# EAGLE design untitled (EAGLE 9.6.2)
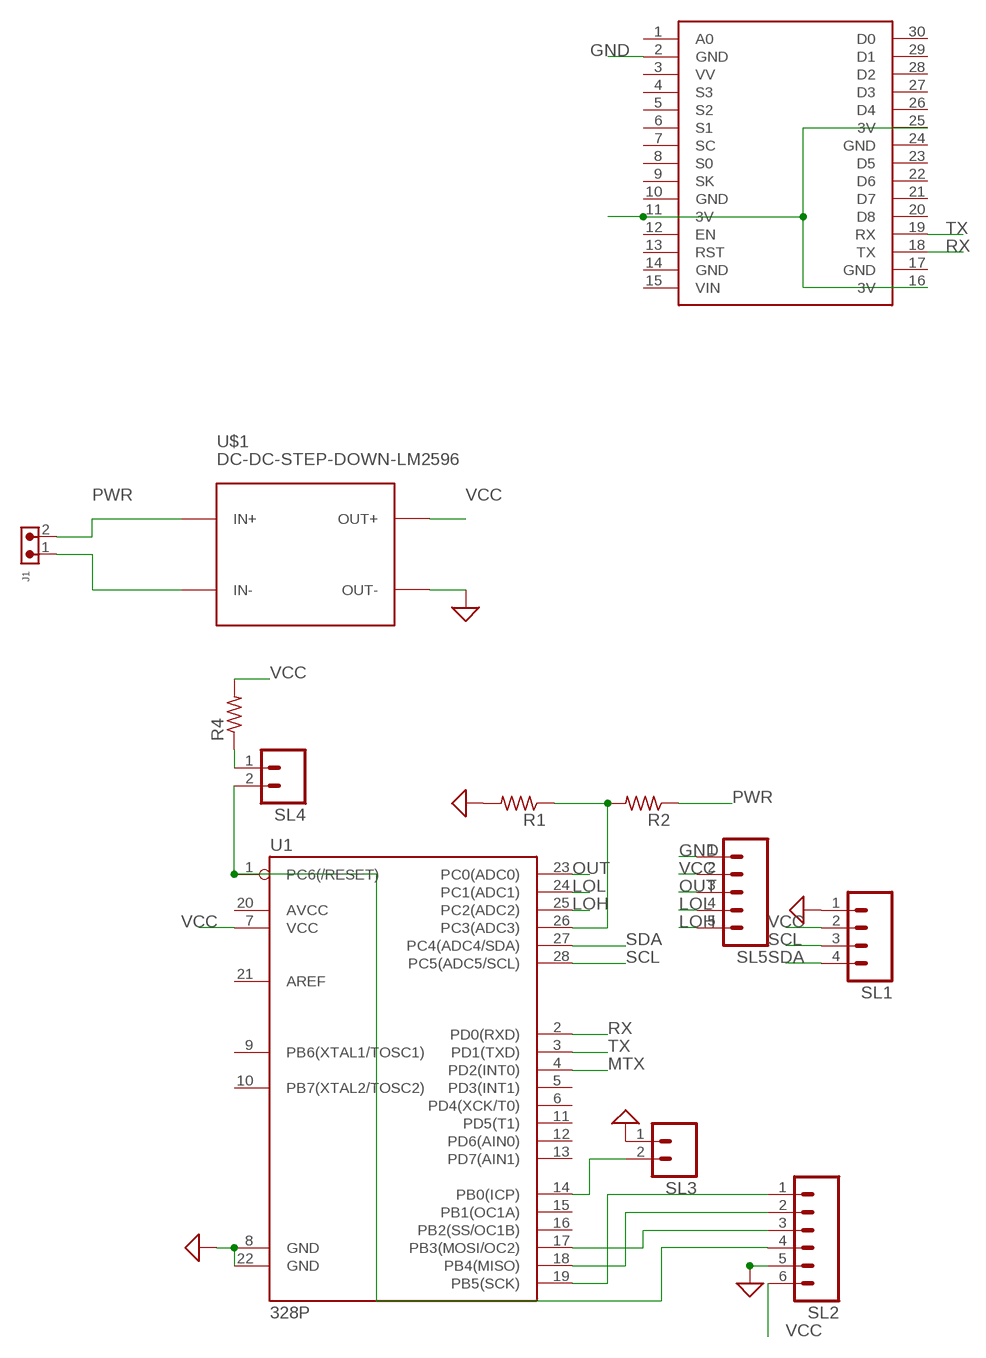
[diagram p0: schematic, sheet 1]

## Parts
J1  691305530002  [691305530002]
R1  R-US_0207/10  [0207/10]
R2  R-US_0207/10  [0207/10]
R4  R-US_0207/10  [0207/10]
SL1  M04  [04P]
SL2  M06  [06P]
SL3  M02  [02P]
SL4  M02  [02P]
SL5  M05  [05P]
U1  328P  ATMEGA328P_PDIP  [DIP28]
U$1  DC-DC-STEP-DOWN-LM2596  [DC-DC-STEP-DOWN-LM2596]
U$3  NODEMCU  [NODEMCU]

## Nets
GND: R1.2 SL1.1 SL2.5 SL3.1 SL5.1 U1.8(GND) U1.22(GND) U$1.OUT- U$3.2(GND) ; supply symbol labelled SUP
LOH: SL5.5 U1.25(PC2(ADC2))
LOL: SL5.4 U1.24(PC1(ADC1))
MTX: U1.4(PD2(INT0))
N$1: R1.1 R2.2 U1.26(PC3(ADC3))
N$2: J1.1 U$1.IN-
N$3: SL3.2 U1.14(PB0(ICP))
N$4: SL2.1 U1.19(PB5(SCK))
N$5: SL2.2 U1.18(PB4(MISO))
N$6: SL2.3 U1.17(PB3(MOSI/OC2))
N$7: SL2.4 SL4.2 U1.1(PC6(/RESET))
N$14: R4.1 SL4.1
OUT: SL5.3 U1.23(PC0(ADC0))
PWR: J1.2 R2.1 U$1.IN+
RX: U1.2(PD0(RXD)) U$3.18(TX)
SCL: SL1.3 U1.28(PC5(ADC5/SCL))
SDA: SL1.4 U1.27(PC4(ADC4/SDA))
TX: U1.3(PD1(TXD)) U$3.19(RX)
VCC: R4.2 SL1.2 SL2.6 SL5.2 U1.7(VCC) U$1.OUT+ U$3.11(3V) U$3.16(3V) U$3.25(3V)
Unconnected: U1.5(PD3(INT1)) U1.6(PD4(XCK/T0)) U1.9(PB6(XTAL1/TOSC1)) U1.10(PB7(XTAL2/TOSC2)) U1.11(PD5(T1)) U1.12(PD6(AIN0)) U1.13(PD7(AIN1)) U1.15(PB1(OC1A)) U1.16(PB2(SS/OC1B)) U1.20(AVCC) U1.21(AREF) U$3.1(A0) U$3.3(VV) U$3.4(S3) U$3.5(S2) U$3.6(S1) U$3.7(SC) U$3.8(S0) U$3.9(SK) U$3.12(EN) U$3.13(RST) U$3.15(VIN) U$3.20(D8) U$3.21(D7) U$3.22(D6) U$3.23(D5) U$3.26(D4) U$3.27(D3) U$3.28(D2) U$3.29(D1) U$3.30(D0)

## Power pins joined to a net without a drawn wire
GND: U$3.10(GND) U$3.14(GND) U$3.17(GND) U$3.24(GND)

## Library data of the parts
J1 = Wurth_Connectors_WR-TBL Pluggable Connector:691305530002: WR-TBL Serie 3055 - 5,08 mm - PCB Header Vertical Entry with Plastic Latches KIND PROPERTIES Pitch 5.08 mm MATERIAL PROPERTIES Insulator Material PA66 Insulator Flammability Rating UL94 V-0 Insulator Color Green Terminal Material Copper Alloy Terminal Plating Tin-plated surface GENERAL INFORMATION Operating Temperature -40 up to +105 °C ELECTRICAL PROPERTIES IR UL 16 A Working Voltage [UL] 300 V (AC) Withstanding Voltage [UL] 2500 V (AC) Contact Resistance [UL] 20 mΩ CERTIFICATION UL Approval E315414 <https://www.we-online.com/catalog/media/o135349v209%20Family_WR-TBL3_6913055300xx.jpg> Details see: https://www.we-online.com/catalog/en/TBL_5_08_3055_6913055300XX/ Updated by Ella Wu 2019-12-30 2019(C) Wurth Elektronik; DATASHEET-URL: https://www.we-online.com/catalog/datasheet/691305530002.pdf; IR-UL: 16A; MOUNT: THT; PART-NUMBER: 691305530002; PINS: 2; PITCH: 5.08mm; TYPE: Vertical; WORKING-VOLTAGE-UL: 300V (AC)
R1 R2 R4 = BeagleBone_Black_Wireless:R-US_: RESISTOR, American symbol
SL1 = con-amp-quick:M04: AMP QUICK CONNECTOR; OC_FARNELL: unknown; OC_NEWARK: unknown
SL2 = con-amp-quick:M06: AMP QUICK CONNECTOR; OC_FARNELL: unknown; OC_NEWARK: unknown
SL3 SL4 = con-amp-quick:M02: AMP QUICK CONNECTOR; OC_FARNELL: unknown; OC_NEWARK: unknown
SL5 = con-amp-quick:M05: AMP QUICK CONNECTOR; OC_FARNELL: unknown; OC_NEWARK: unknown
U1 = SparkFun-IC-Microcontroller:ATMEGA328P_PDIP: Atmel 328P Through hole ATMEGA328P uC used in the Arduino 32kb flash, 1k EEPROM, 2k SRAM Datasheet <http://www.sparkfun.com/datasheets/Components/SMD/ATMega328.pdf> SparkFun Products Storefront component: AVR 28 Pin 20MHz 32K 6A/D - ATMega328P <https://www.sparkfun.com/products/9061> (COM-09061) SparkFun Simon Says - Through-Hole Soldering Kit <https://www.sparkfun.com/products/10547> (KIT-10547) SparkFun Learn to Solder - Simon Says <https://www.sparkfun.com/products/13708> (KIT-13708) SparkFun BigTime Watch Kit <https://www.sparkfun.com/products/11734> (KIT-11734) SparkFun ClockIt <https://www.sparkfun.com/products/10930> (KIT-10930) SparkFun Serial Enabled LCD Kit <https://www.sparkfun.com/products/10097> (LCD-10097) SparkFun Simon Tilts - Through Hole Soldering Kit <https://www.sparkfun.com/products/12634> (KIT-12634) SparkFun Frequency Counter Kit <https://www.sparkfun.com/products/10140> (KIT-10140) FabFM Radio Kit <https://www.sparkfun.com/products/11043> (KIT-11043) SparkFun Binary Blaster Kit <https://www.sparkfun.com/products/12037> (KIT-12037) SparkFun Metro-Gnome <https://www.sparkfun.com/products/9236> (KIT-09236) ATmega328 with Arduino Optiboot (Uno) <https://www.sparkfun.com/products/10524> (DEV-10524); PROD_ID: IC-09136
U$1 = diy-modules:DC-DC-STEP-DOWN-LM2596: DC/DC Step-Down Regulator based on LM2596-ADJ chip LM2596 datasheet available here: http://www.ti.com/lit/ds/symlink/lm2596.pdf Click here to find device on ebay.com <http://www.ebay.com/sch/lm2596+power+regulator>
U$3 = nodemcu:NODEMCU

## Board
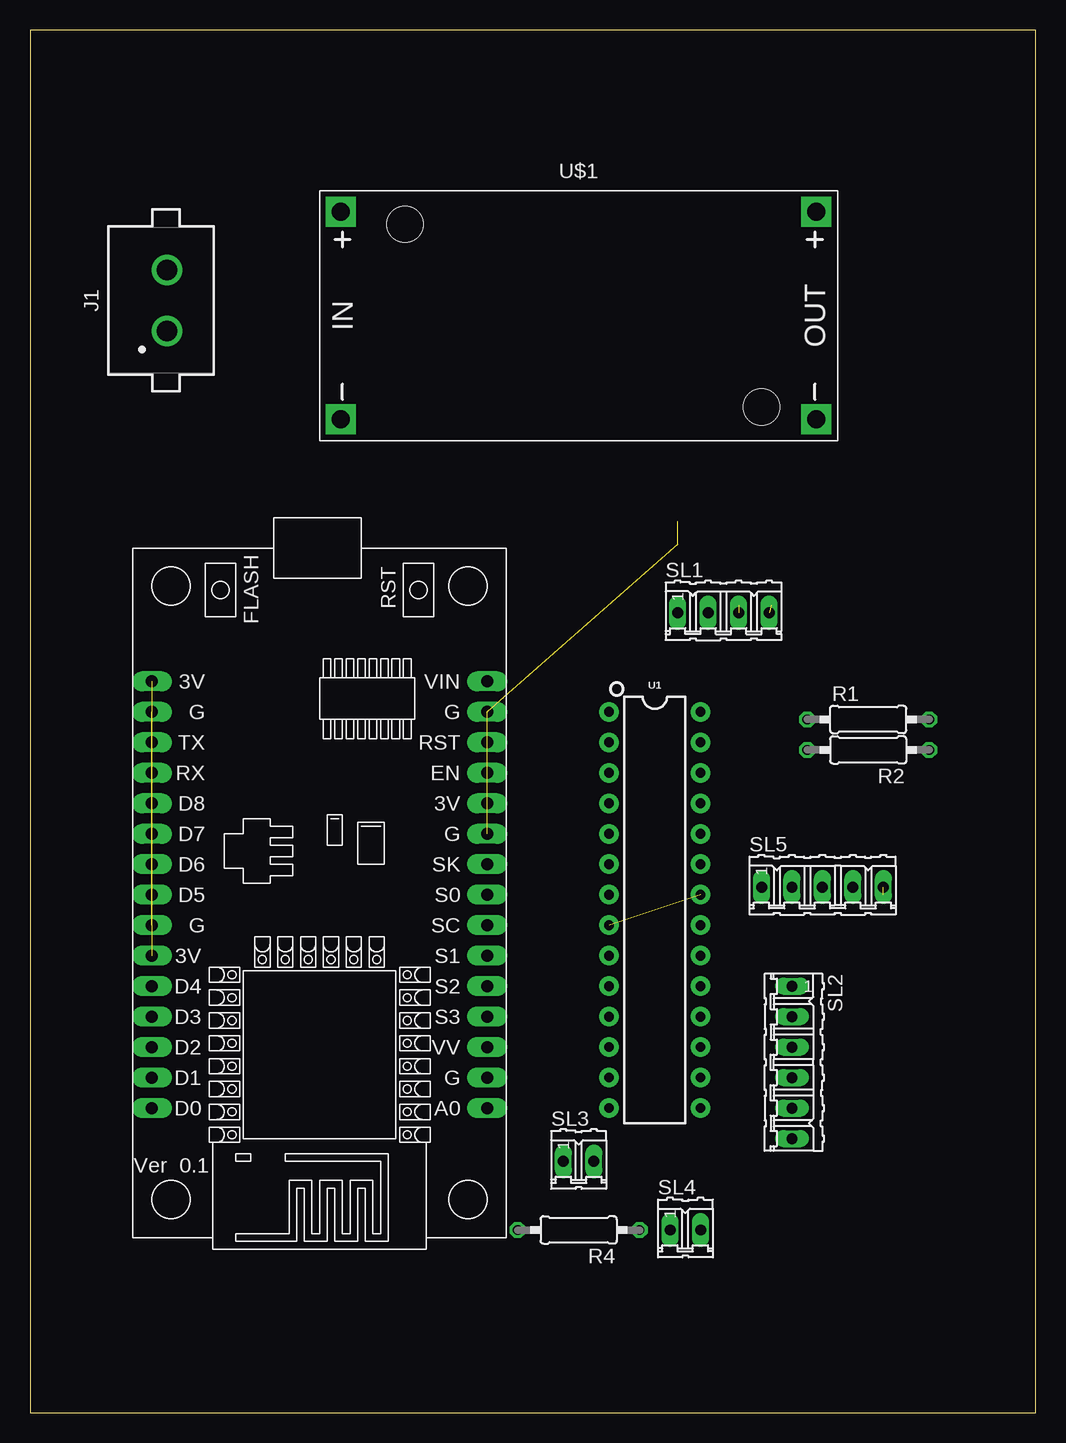
[diagram p1: board, top side]
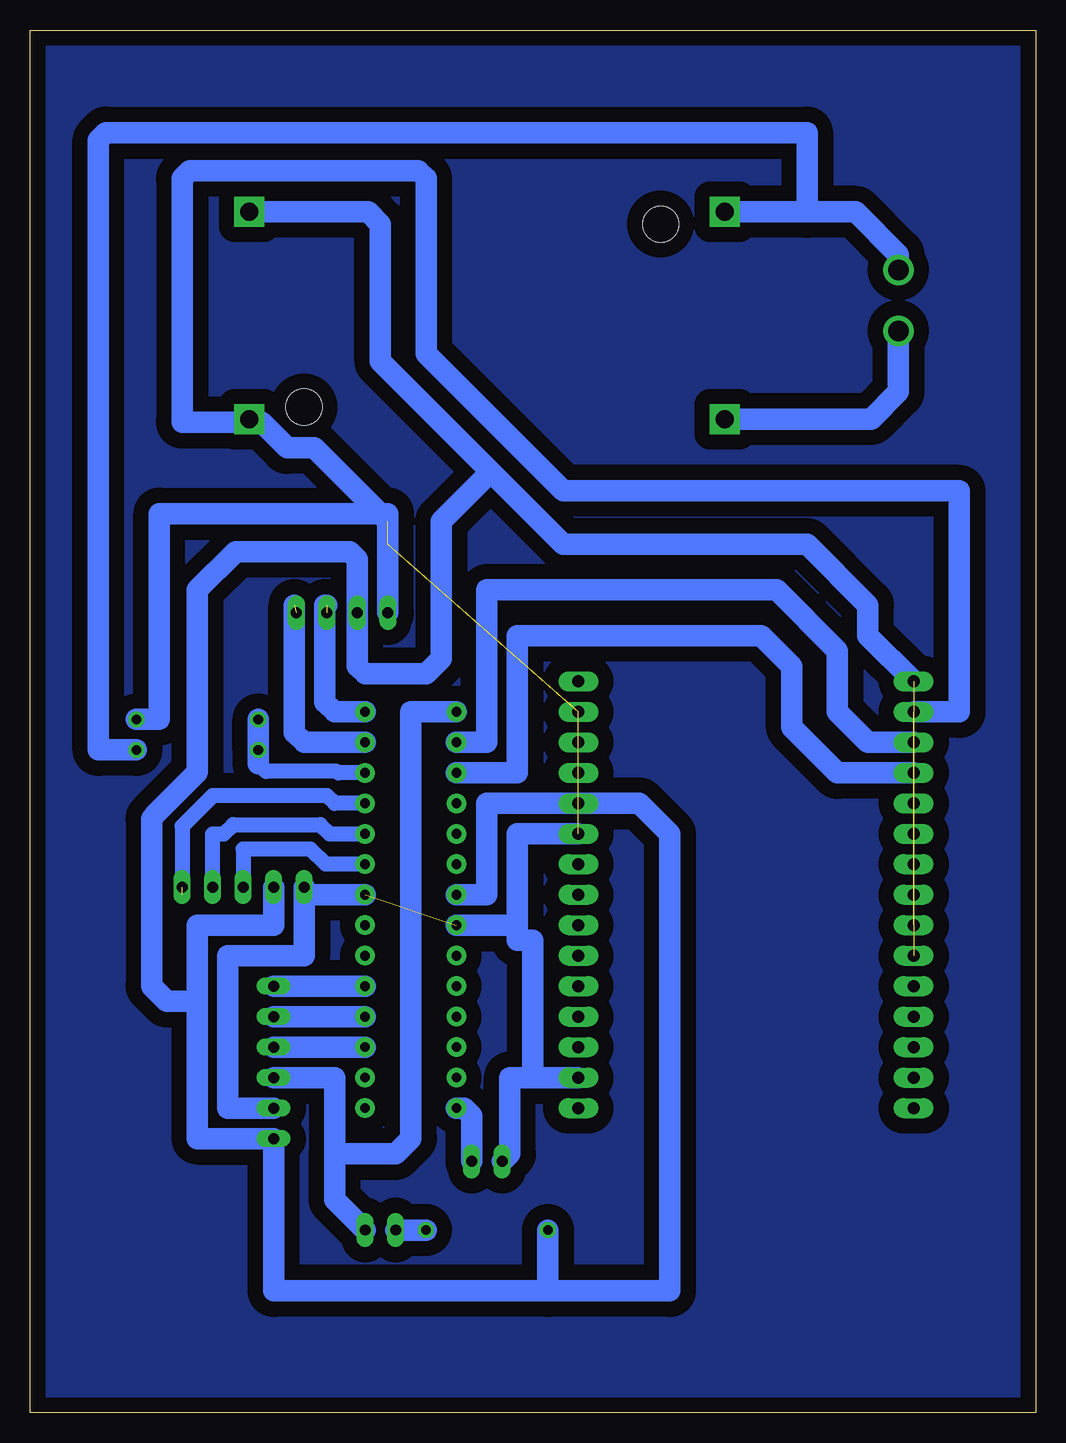
[diagram p2: board, bottom side, seen from below]

Size 83.8 x 115.24 mm. Coordinates in mm from the lower left corner, seen from the top.
Outline: 0,0 83.8,0 83.8,115.24 0,115.24 0,0
Copper layers (1*16): Top 0.035mm / dielectric 1.5mm / Bottom 0.035mm
Design rules "default *": minimum track width 6mil, minimum drill 0.35mm, track to track 30mil, track to pad 30mil, pad to pad 30mil, via to via 30mil, smd to smd 6mil, copper to edge 40mil, drill to drill 6mil, minimum pad ring 10mil, minimum via ring 8mil, stop-mask expansion 4mil, vias tented up to drill 0mil, thermal gap 10mil

### Footprints (pad centres in the part's own frame; a part is rotated, then mirrored left to right if it is on the bottom)
691305530002 = drill 1.7: 1 -2.54,0; 2 2.54,0
0207/10 = drill 0.813 octagon: 1 -5.08,0; 2 5.08,0
04P = drill 0.914 long: 1 -3.81,0; 2 -1.27,0; 3 1.27,0; 4 3.81,0
06P = drill 0.914 long: 1 -6.35,0; 2 -3.81,0; 3 -1.27,0; 4 1.27,0; 5 3.81,0; 6 6.35,0
02P = drill 0.914 long: 1 -1.27,0; 2 1.27,0
05P = drill 0.914 long: 1 -5.08,0; 2 -2.54,0; 3 0,0; 4 2.54,0; 5 5.08,0
DIP28 = drill 0.813 pad 1.626: 1 -16.51,-3.81; 2 -13.97,-3.81; 3 -11.43,-3.81; 4 -8.89,-3.81; 5 -6.35,-3.81; 6 -3.81,-3.81; 7 -1.27,-3.81; 8 1.27,-3.81; 9 3.81,-3.81; 10 6.35,-3.81; 11 8.89,-3.81; 12 11.43,-3.81; 13 13.97,-3.81; 14 16.51,-3.81; 15 16.51,3.81; 16 13.97,3.81; 17 11.43,3.81; 18 8.89,3.81; 19 6.35,3.81; 20 3.81,3.81; 21 1.27,3.81; 22 -1.27,3.81; 23 -3.81,3.81; 24 -6.35,3.81; 25 -8.89,3.81; 26 -11.43,3.81; 27 -13.97,3.81; 28 -16.51,3.81
DC-DC-STEP-DOWN-LM2596 = drill 1.5 pad 2.5 square: IN+ -19.812,8.636; IN- -19.812,-8.636; OUT+ 19.812,8.636; OUT- 19.812,-8.636 | hole 3: -14.478,7.62; 15.24,-7.62
NODEMCU = drill 1 pad 1.676 long: 1 -13.97,17.78; 2 -13.97,15.24; 3 -13.97,12.7; 4 -13.97,10.16; 5 -13.97,7.62; 6 -13.97,5.08; 7 -13.97,2.54; 8 -13.97,0; 9 -13.97,-2.54; 10 -13.97,-5.08; 11 -13.97,-7.62; 12 -13.97,-10.16; 13 -13.97,-12.7; 14 -13.97,-15.24; 15 -13.97,-17.78; 16 13.97,-17.78; 17 13.97,-15.24; 18 13.97,-12.7; 19 13.97,-10.16; 20 13.97,-7.62; 21 13.97,-5.08; 22 13.97,-2.54; 23 13.97,0; 24 13.97,2.54; 25 13.97,5.08; 26 13.97,7.62; 27 13.97,10.16; 28 13.97,12.7; 29 13.97,15.24; 30 13.97,17.78

### Placement (x,y rotation side)
J1  11.43,92.71 90 top
R1  69.85,57.79 0 top
R2  69.85,55.24 180 top
R4  45.72,15.24 180 top
SL1  57.78,66.68 0 top
SL2  63.5,29.21 270 top
SL3  45.72,20.95 0 top
SL4  54.61,15.24 0 top
SL5  66.04,43.82 0 top
U1  52.07,41.91 270 top
U$1  45.72,91.44 0 top
U$3  24.13,43.18 180 top

### Tracks (layer width: path | path; a pad name or v marks a point on that pad's centre or on a via)
GND  (5 unrouted)
  Bottom 1.778: 65.79,82.55 71.12,82.55 71.12,102.87 70.48,103.5 51.44,103.5 50.8,102.87 50.8,88.27 39.37,76.84 6.35,76.84 6.35,58.42 U$3.17 | 65.79,82.55 U$1.OUT- | U$3.10 43.18,48.26 43.18,40.64 | 43.18,40.64 43.18,39.37 41.91,39.37 41.91,27.94 | U1.8 43.18,40.64 | SL2.5 67.31,25.4 67.31,38.1 60.96,38.1 60.96,43.18 | 41.91,27.94 U$3.2 | SL3.1 43.81,21.59 43.81,27.94 41.91,27.94 | U1.22 60.96,43.18 | SL1.1 53.97,74.29 | 53.97,74.29 53.97,74.93 73.02,74.93 73.02,57.79 R1.2 | 65.79,82.55 64.5,82.55 62.37,80.41 60.09,80.41 53.97,74.29 | 60.96,43.18 SL5.1
LOH  (1 unrouted)
  Bottom 1.27: 71.12,43.18 71.12,48.9 68.58,51.43 59.05,51.43 58.42,50.8 U1.25
LOL
  Bottom 1.27: SL5.4 68.58,48.26 67.64,48.26 66.88,49.02 59.6,49.02 58.84,48.26 U1.24
N$1
  Bottom 1.27: U1.26 58.09,53.34 58.21,53.47 64.13,53.47 64.77,54.1
  Bottom 1.778: R1.1 R2.2 64.77,54.1
N$2
  Bottom 1.778: J1.1 11.43,85.09 13.72,82.8 U$1.IN-
N$3
  Bottom 1.778: SL3.2 46.99,24.77 47.62,25.4 U1.14
N$4
  Bottom 1.778: U1.19 SL2.1
N$5
  Bottom 1.778: SL2.2 U1.18
N$6
  Bottom 1.778: U1.17 SL2.3
N$7
  Bottom 1.778: SL2.4 58.42,27.94 58.42,21.59 | 58.42,21.59 53.34,21.59 52.07,22.86 52.07,58.42 U1.1 | SL4.2 58.42,17.78 58.42,21.59
N$8
  pour Bottom (isolate 1.27): 0,115.57 83.82,115.57 83.82,0 0,0
N$14
  Bottom 1.778: R4.1 SL4.1
OUT
  Bottom 1.27: U1.23 59.17,45.72 60.44,46.99 66.04,46.99 SL5.3
PWR
  Bottom 1.778: J1.2 11.43,96.52 14.99,100.08 19.05,100.08 | 19.05,100.08 U$1.IN+ | 19.05,100.08 19.05,106.68 77.47,106.68 78.1,106.05 78.1,55.24 R2.1
RX
  Bottom 1.778: U1.2 45.72,55.88 45.72,68.58 21.59,68.58 16.51,63.5 16.51,58.42 13.97,55.88 U$3.18
SCL  (1 unrouted)
  Bottom 1.778: U1.28 58.42,58.42 59.23,59.23 59.23,67.31 59.05,67.31
SDA  (1 unrouted)
  Bottom 1.778: U1.27 60.96,55.88 61.77,56.69 61.77,67.31
TX
  Bottom 1.778: U$3.19 16.51,53.34 20.32,57.15 20.32,62.23 22.86,64.77 43.18,64.77 43.18,53.34 U1.3
VCC  (1 unrouted)
  Bottom 1.778: U1.7 45.72,43.18 45.72,50.8 U$3.11 33.02,50.8 30.48,48.26 30.48,10.16 40.64,10.16 | U$3.16 13.97,64.77 13.97,67.31 19.05,72.39 39.37,72.39 45.4,78.42 | U$1.OUT+ 55.63,100.08 54.61,99.06 54.61,87.63 45.4,78.42 | 40.64,10.16 63.5,10.16 SL2.6 69.85,22.86 69.85,34.29 | R4.2 40.64,10.16 | SL5.2 63.5,40.64 69.85,40.64 69.85,34.29 | 45.4,78.42 49.53,74.29 49.53,62.87 50.8,61.6 55.88,61.6 56.52,62.23 SL1.2 56.52,71.12 57.15,71.75 66.67,71.75 69.85,68.58 69.85,53.4 73.41,49.84 73.41,49.78 73.66,49.53 73.66,35.56 72.39,34.29 69.85,34.29